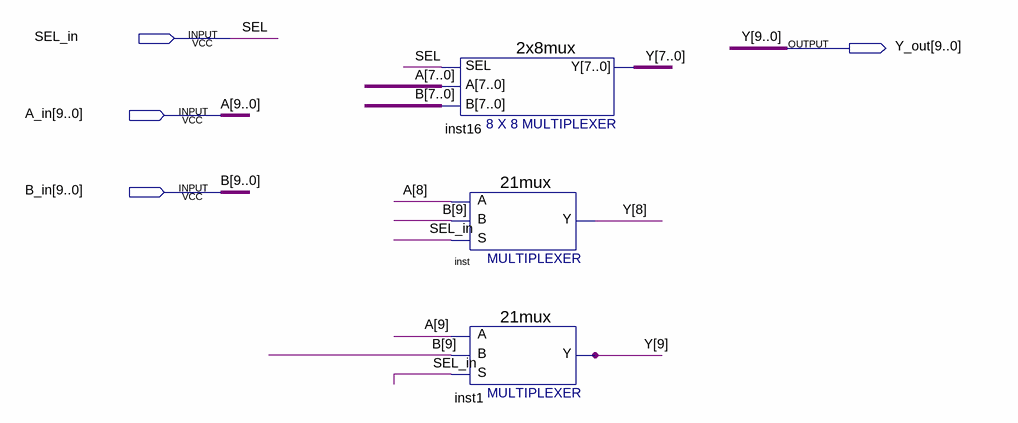
[diagram p0: schematic sheet]
// Quartus schematic 2x10Mux.bdf as structural Verilog: 3 symbols, 4 pins
module \2x10Mux  (
  input  SEL_in,
  input  [9:0] A_in,
  input  [9:0] B_in,
  output [9:0] Y_out
);

  \2x8mux  inst16 (.SEL(SEL_in), .A(A_in[7:0]), .B(B_in[7:0]), .Y(Y_out[7:0]));
  \21mux  inst (.S(SEL_in), .B(B_in[9]), .A(A_in[8]), .Y(Y_out[8]));
  \21mux  inst1 (.S(SEL_in), .B(B_in[9]), .A(A_in[9]), .Y(Y_out[9]));

  // Other names for the same wires on the sheet: A[9:0] = A_in; B[9:0] = B_in; SEL = SEL_in; Y[9:0] = Y_out
endmodule
